# Altium schematic sheet DC48V_DC24V_200W_V2.0.SchDoc
size A4; SheetNumber: 1; SheetTotal: 1
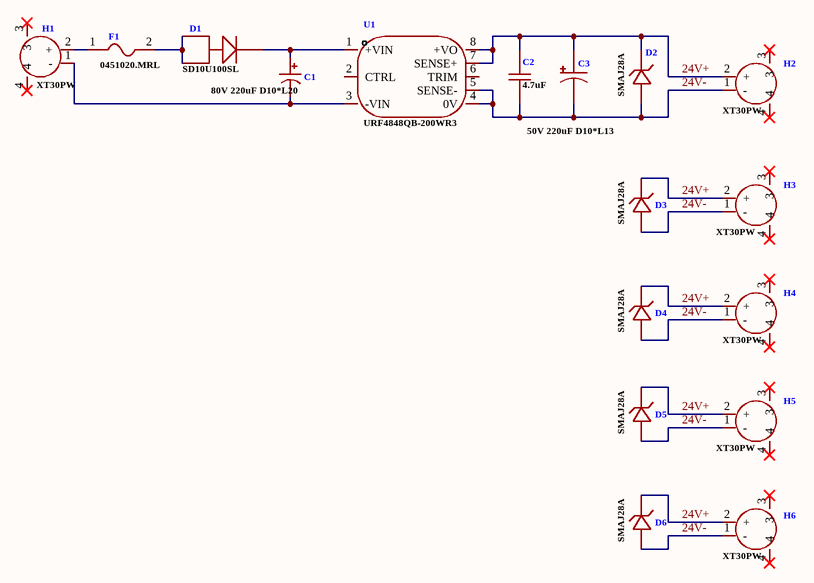
[diagram p0: DC48V_DC24V_200W_V2.0.SchDoc]

## Parts
C1  80V 220uF D10*L20  [CAP-TH_BD10.0-P5.00-D1.0-FD-WL]
C2  4.7uF  [1210_C]
C3  50V 220uF D10*L13  [CAP-TH_BD10.0-P5.00-D1.0-FD]
D1  SD10U100SL  [TO-227B-SMD_L6.1-W4.3-LS7.0-RD]
D2  SMAJ28A  [SMA_L4.4-W2.8-LS5.4-RD]
D3  SMAJ28A  [SMA_L4.4-W2.8-LS5.4-RD]
D4  SMAJ28A  [SMA_L4.4-W2.8-LS5.4-RD]
D5  SMAJ28A  [SMA_L4.4-W2.8-LS5.4-RD]
D6  SMAJ28A  [SMA_L4.4-W2.8-LS5.4-RD]
F1  0451020.MRL  [FUSE-SMD_L6.1-W2.7]
H1  XT30PW  [CONN-TH_XT30PW-M]
H2  XT30PW  [CONN-TH_XT30PW-M]
H3  XT30PW  [CONN-TH_XT30PW-M]
H4  XT30PW  [CONN-TH_XT30PW-M]
H5  XT30PW  [CONN-TH_XT30PW-M]
H6  XT30PW  [CONN-TH_XT30PW-M]
U1  URF4848QB-200WR3  [PWRM-TH_URF48XXQB-200WR3]

## Nets
24V+: C2.2 C3.1 D2.1 D3.1 D4.1 D5.1 D6.1 H2.2(+) H3.2(+) H4.2(+) H5.2(+) H6.2(+) U1.7(SENSE+) U1.8(+VO)
24V-: C2.1 C3.2 D2.2 D3.2 D4.2 D5.2 D6.2 H2.1(-) H3.1(-) H4.1(-) H5.1(-) H6.1(-) U1.4(0V) U1.5(SENSE-)
NetC1_1: C1.1 D1.3 U1.1(+VIN)
NetC1_2: C1.2 H1.1(-) U1.3(-VIN)
NetD1_1: D1.1 D1.2 F1.2
NetF1_1: F1.1 H1.2(+)

Not connected (* = marked no-connect by the designer): H1 3* 4*; H2 3* 4*; H3 3* 4*; H4 3* 4*; H5 3* 4*; H6 3* 4*; U1 2(CTRL) 6(TRIM)

## Library data of the parts
C1 = ERF1BM221G20OT: Manufacturer: AISHI(艾华集团); Add into BOM: yes; Tolerance: ±20%; Pin Spacing: 5mm; Lifetime: 5000hrs@105℃; Symbol: ERF1BM221G20OT; Device: ERF1BM221G20OT; LCSC Part Name: 220uF ±20% 80V; Supplier Part: C106516; Manufacturer Part: ERF1BM221G20OT; Supplier Footprint: 插件,D10xL20mm; JLCPCB Part Class: Extended Part; Datasheet: https://item.szlcsc.com/datasheet/ERF1BM221G20OT/107732.html; Supplier: LCSC; Convert to PCB: yes; Value: 220uF; Voltage Rating: 80V; Ripple Current: -; Equivalent Series Resistance(ESR): -; Diameter: 10mm; Height - Seated (Max): 20mm
C2 = 1210 4.7uf: 100V 4.7uf 1210; Manufacturer: FH(风华); Symbol: 1210B475K101NT; Add into BOM: yes; Tolerance: ±10%; Temperature Coefficient: X7R; Device: 1210B475K101NT; LCSC Part Name: 4.7uF ±10% 100V; Supplier Part: C2840282; Manufacturer Part: 1210B475K101NT; Supplier Footprint: 1210; JLCPCB Part Class: Extended Part; Datasheet: https://atta.szlcsc.com/upload/public/pdf/source/20210617/C2840282_5B7AB5BFD77495008CFAB3FC2796A0E9.pdf; Supplier: LCSC; Convert to PCB: yes; Value: 4.7uF; Voltage Rated: 100V
C3 = ERS1HM221G13OT: Manufacturer: AISHI(艾华集团); Add into BOM: yes; Tolerance: ±20%; Pin Spacing: 5mm; Lifetime: 7000hrs@105℃; Symbol: ERS1HM221G13OT; Device: ERS1HM221G13OT; LCSC Part Name: 220uF ±20% 50V; Supplier Part: C383039; Manufacturer Part: ERS1HM221G13OT; Supplier Footprint: 插件,D10xL13mm; JLCPCB Part Class: Extended Part; Datasheet: https://item.szlcsc.com/datasheet/ERS1HM221G13OT/356226.html; Supplier: LCSC; Convert to PCB: yes; Value: 220uF; Voltage Rating: 50V; Diameter: 10mm; Height - Seated (Max): 13mm
D1 = SD10U100SL: Manufacturer: LGE(鲁光); Add into BOM: yes; Diode Configuration: 独立式; Forward Voltage (Vf@If): 570mV@10A; Reverse Voltage (Vr): 100V; Rectified Current: 10A; Reverse Leakage Current (Ir): 200uA@100V; Symbol: SD10U100SL; Device: SD10U100SL; LCSC Part Name: 电压:100V 电流:10A; Supplier Part: C2903879; Manufacturer Part: SD10U100SL; Supplier Footprint: TO-277; JLCPCB Part Class: Extended Part; Datasheet: https://atta.szlcsc.com/upload/public/pdf/source/20211009/BD93C46FB22A14806A56CC8AAFB52095.pdf; Supplier: LCSC; Convert to PCB: yes
D2-D6 = SMAJ28A_C148227: Manufacturer: Littelfuse(美国力特); Add into BOM: yes; Polarity: 单向; Reverse Stand-Off Voltage (Vrwm): 28V; Clamping Voltage: 45.4V; Peak Pulse Current (Ipp): 8.8A@10/1000us; Peak Pulse Power Dissipation (Ppp): 400W@10/1000us; Voltage - Breakdown: 34.4V; Reverse Leakage Current (Ir): 1uA; level of protection: IEC 61000-4-4；IEC 61000-4-2; Type: TVS; Symbol: SMAJ28A_C148227; Device: SMAJ28A_C148227; LCSC Part Name: SMAJ28A; Supplier Part: C148227; Manufacturer Part: SMAJ28A; Supplier Footprint: SMA(DO-214AC); JLCPCB Part Class: Extended Part; Datasheet: https://item.szlcsc.com/datasheet/SMAJ28A/159560.html; Supplier: LCSC; Convert to PCB: yes; Operating Temperature: -65℃~+150℃
F1 = 0451020.MRL: Manufacturer: Littelfuse(美国力特); Add into BOM: yes; Type: 贴片式保险丝; Current Rating: 20A; Voltage Rating (AC): 65V; Interrupt Rating: 150A；100A; Symbol: 0451020.MRL; Device: 0451020.MRL; LCSC Part Name: 65V贴片式保险丝; Supplier Part: C178980; Manufacturer Part: 0451020.MRL; Supplier Footprint: 2410; JLCPCB Part Class: Extended Part; Datasheet: https://item.szlcsc.com/datasheet/0451020.MRL/190373.html; Supplier: LCSC; Convert to PCB: yes; Voltage Rating (DC): 65V; Operating Temperature: -55℃~+125℃
H1-H6 = XT30PW-M30.G.Y: Manufacturer: AMASS(艾迈斯); Add into BOM: yes; RatedVoltage: DC 500V; InterfaceType: 公头; RatedCurrent: 15A; RecommendedWireGauge: 16/18/20AWG; contact resistance: 1.2mΩ; specifications: 2pin; Symbol: XT30PW-M; Device: XT30PW-M30.G.Y; LCSC Part Name: AMASS(艾迈斯)航模插头 卧式弯脚 XT30PW-M公头; Supplier Part: C431092; Manufacturer Part: XT30PW-M30.G.Y; Supplier Footprint: -; JLCPCB Part Class: Extended Part; Datasheet: https://atta.szlcsc.com/upload/public/pdf/source/20220222/6A9F22F7850E25B33E1BE430ADF8560B.pdf; Supplier: LCSC; Convert to PCB: yes; Power: -; Output: -; Input: -; Size: -; Interface: -; Type: 航模插头; Colour: -; MaximumCurrent: -; Type1: -; NumberOfUSBHoles: -; MetalMaterial: -; InsulationMaterial: -; FlameRetardantGrade: -; Belt length: -
U1 = URF4848QB-200WR3: Manufacturer: MORNSUN(金升阳); Add into BOM: yes; Output Power: 200W; Voltage - Supply: 18V~75V; Conversion Efficiency: 91%; Output Voltage: 48V; Output Current(Max): 4.2A; Capacitive Load(Max): 450uF; Isolation Voltage(Vrms): 2.25kV; Value: 250kHz; Ripple Noise: 150mVp-p; Symbol: URF4848QB-200WR3; Device: URF4848QB-200WR3; LCSC Part Name: URF4848QB-200WR3; Supplier Part: C6705194; Manufacturer Part: URF4848QB-200WR3; Supplier Footprint: DIP,61.8x40.2mm; JLCPCB Part Class: Extended Part; Datasheet: https://item.szlcsc.com/datasheet/URF4848QB-200WR3/7661650.html; Supplier: LCSC; Convert to PCB: yes; Features: 欠压保护；短路保护；过流保护；过压保护；过热保护; Operating Temperature: -40℃~+85℃; Length: 61.8mm; Width: 40.2mm; Height: 12.7mm